# Altium project FMC_ADC.PrjPcb (part 4 of 4)

## Sheet TRIGGER.SchDoc: Trigger
size A3; Author: Wojciech Ruc³o; Organization: Warsaw Univeristy of Technology; Address1: Nowowiejska 15/19; DocumentNumber: 10; Revision: 1.0; SheetNumber: 10; SheetTotal: 12
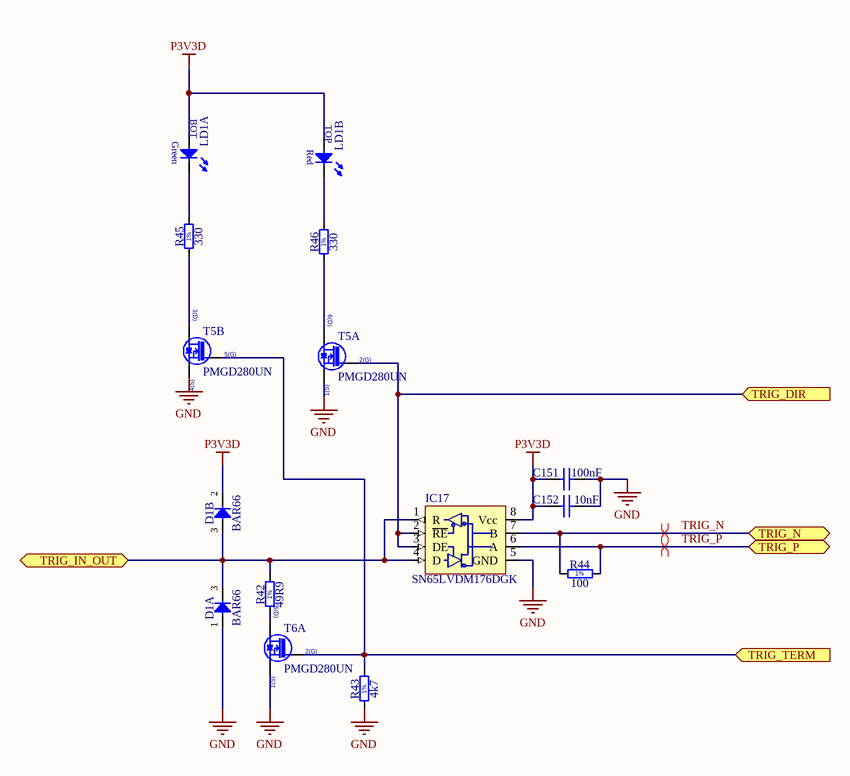
[diagram p10: TRIGGER.SchDoc]

### Parts
C151  100nF  [CAPC0603X33N]
C152  10nF  [CAPC0603X33N]
D1  BAR66  [SOT95P240X110-3N]  (parts A,B of 2)
IC17  SN65LVDM176DGK  [MSOP8 TI/AD]
LD1  (no value)  [553-xxxx-300]  (parts A,B of 2)
R42  49R9  [RESC3225X70N]
R43  4k7  [RESC1005X40N]
R44  100  [RESC1005X40N]
R45  330  [RESC1005X40N]
R46  330  [RESC1005X40N]
T5  PMGD280UN  [SOT65P210X110-6N]  (parts A,B of 2)
T6  PMGD280UN  [SOT65P210X110-6N]  (part A of 2)

### Ports
TRIG_DIR (in), TRIG_IN_OUT (bidir), TRIG_N (bidir), TRIG_P (bidir), TRIG_TERM (in)

### Nets
GND: C151.2 C152.2 D1.1(A) IC17.5(GND) R43.1 T5.1(S) T5.4(S) T6.1(S)
P3V3D: C151.1 C152.1 D1.2(C) IC17.8(Vcc) LD1.2(A) LD1.4(A)
LA22_P: IC17.2(~{RE}) IC17.3(DE) T5.2(G) ; port TRIG_DIR
LA27_N: R43.2 T5.5(G) T6.2(G) ; port TRIG_TERM
TRIG_N: IC17.7(B) R44.1 ; port TRIG_N  [project net LA11_N]
TRIG_P: IC17.6(A) R44.2 ; port TRIG_P  [project net LA11_P]
NetD1_3: D1.3(COMAC) IC17.1(R) IC17.4(D) R42.2 ; port TRIG_IN_OUT
NetLD1_1: LD1.1(C) R45.2
NetLD1_3: LD1.3(C) R46.2
NetR42_1: R42.1 T6.6(D)
NetR45_1: R45.1 T5.3(D)
NetR46_1: R46.1 T5.6(D)

### Layout directives
differential pair: LA11_N, LA11_P

### Notes on the sheet
- Title
- Size:
- Date:
- A3
- Number:
- Revision:
- Sheet
- of
- Drawn by:
- File:
- (in symbol LED x2 Red/Green 553-0711-300, part A) BOT; Green
- (in symbol LED x2 Red/Green 553-0711-300, part B) TOP; Red
- (in symbol PMGD280UN, part A) 6(D); 2(G); 1(S)
- (in symbol PMGD280UN, part B) 3(D); 5(G); 4(S)
- (in symbol R0402_4K7_1%_0.0625W_100PPM) 1%
- (in symbol R0402_100R_1%_0.0625W_100PPM) 1%
- (in symbol R0402_330R_1%_0.0625W_100PPM) 1%
- (in symbol R1210_49R9_1%_0.5W_100PPM_VISHAY_CRCW) 1%

### Library data of the parts
C151 = CC0201_100NF_6.3V_10%_X5R: Non-polarised capacitor; Part Description: SMD Multilayer Chip Ceramic Capacitor; Manufacturer: GENERIC; Manufacturer1 Part Number: 02016D104KAT2A; Voltage: 6.3V; TC: X5R; Tolerance: ±10%; Part Number: CC0201_100NF_6.3V_10%_X5R; Component Kind: Standard; Component Type: Standard; Pin Count: 2; Value: 100nF; Status: Not Recommended; Manufacturer Part Number: CC0201_100NF_6.3V_10%_X5R; Case: 0201; Mounted: Yes; Socket: No; SMD: Yes; Manufacturer1 Example: AVX; Manufacturer1 ComponentHeight: 0.33mm; HelpURL: \\cern.ch\dfs\Applications\Altium\Datasheets\CC0201_X5R_AVX.pdf; Author: CERN DEM JLC; CreateDate: 03.12.2007; LatestRevisionDate: 03.12.2007; Sense: No
C152 = CC0201_10NF_10V_10%_X5R: Non-polarised capacitor; Part Description: SMD Multilayer Chip Ceramic Capacitor; Manufacturer: GENERIC; Manufacturer1 Part Number: 0201ZD103KAT2A; Voltage: 10V; TC: X5R; Tolerance: ±10%; Part Number: CC0201_10NF_10V_10%_X5R; Component Kind: Standard; Component Type: Standard; Pin Count: 2; Value: 10nF; Status: Not Recommended; Manufacturer Part Number: CC0201_10NF_10V_10%_X5R; Case: 0201; Mounted: Yes; Socket: No; SMD: Yes; Manufacturer1 Example: AVX; Manufacturer1 ComponentHeight: 0.33mm; HelpURL: \\cern.ch\dfs\Applications\Altium\Datasheets\CC0201_X5R_AVX.pdf; Author: CERN DEM JLC; CreateDate: 03.12.2007; LatestRevisionDate: 03.12.2007; Sense: No
D1 = BAR66: Serial Diode; Part Description: Silicon PIN Diode Array (Series Connected); Manufacturer: INFINEON; Voltage: 150V; Power: 250mA; PressFit: No; Bonding: No; Part Number: BAR66; Component Kind: Standard; Component Type: Standard; Device: BAR66; PackageDescription: SOT23 3-Leads, Pitch 0.95mm - Body 1.3x2.9mm, IPC Medium Density; Manufacturer Part Number: BAR66; Pin Count: 3; Mounted: Yes; Socket: No; SMD: Yes; ComponentHeight: 1.1mm; HelpURL: \\cern.ch\dfs\Applications\Altium\Datasheets\BAR66.pdf; Author: CERN DEM JLC; CreateDate: 18.01.2010; LatestRevisionDate: 05.10.2010; Case: SOT23; Sense: No
IC17 = SN65LVDM176: High Speed Differential Transceiver LVDS/LVTTL; Manufacturer: Texas Instruments; Manufacturer Part Number: SN65LVDM176DGK
LD1 = LED x2 Red/Green 553-0711-300: Manufacturer: Dialight; Manufacturer Part Number: 553-0711-300; ComponentHeight: 9.65mm
R42 = R1210_49R9_1%_0.5W_100PPM_VISHAY_CRCW: Resistor - 1%; Part Description: Thick Film Chip Resistor; Manufacturer: VISHAY DRALORIC; Manufacturer Part Number: CRCW121049R9FKTA; Power: 0.5W; TC: ±100ppm/°C; Part Number: R1210_49R9_1%_0.5W_100PPM_VISHAY_CRCW; Component Kind: Standard; Component Type: Standard; Pin Count: 2; Value: 49R9; Status: None; Tolerance: ±1%; Case: 1210; Mounted: Yes; Sense: No; Socket: No; SMD: Yes; ComponentHeight: 0.6mm; HelpURL: \\cern.ch\dfs\Applications\Altium\Datasheets\R1210_VISHAY_CRCW1210.pdf; Author: CERN DEM JMW; CreateDate: 06.08.2014; LatestRevisionDate: 06.08.2014
R43 = R0402_4K7_1%_0.0625W_100PPM: Resistor - 1%; Part Description: General Purpose Thick Film Chip Resistor; Manufacturer: GENERIC; Manufacturer1 Part Number: 232270674702L; TC: ±100ppm/°C; Part Number: R0402_4K7_1%_0.0625W_100PPM; Component Kind: Standard; Component Type: Standard; Pin Count: 2; Value: 4k7; Status: Not recommended; Power: 0.0625W; Tolerance: ±1%; Manufacturer Part Number: R0402_4K7_1%_0.0625W_100PPM; Case: 0402; Mounted: Yes; Socket: No; SMD: Yes; Manufacturer1 Example: YAGEO PHYCOMP; Manufacturer1 ComponentHeight: 0.4mm; HelpURL: \\cern.ch\dfs\Applications\Altium\Datasheets\R0402_Phycomp_RC0402.pdf; Author: CERN DEM JLC; CreateDate: 03.12.2007; LatestRevisionDate: 17.10.2012; Sense: No
R44 = R0402_100R_1%_0.0625W_100PPM: Resistor - 1%; Part Description: General Purpose Thick Film Chip Resistor; Manufacturer: GENERIC; Manufacturer1 Part Number: 232270671001L; TC: ±100ppm/°C; Part Number: R0402_100R_1%_0.0625W_100PPM; Component Kind: Standard; Component Type: Standard; Pin Count: 2; Value: 100; Status: Not recommended; Power: 0.0625W; Tolerance: ±1%; Manufacturer Part Number: R0402_100R_1%_0.0625W_100PPM; Case: 0402; Mounted: Yes; Socket: No; SMD: Yes; Manufacturer1 Example: YAGEO PHYCOMP; Manufacturer1 ComponentHeight: 0.4mm; HelpURL: \\cern.ch\dfs\Applications\Altium\Datasheets\R0402_Phycomp_RC0402.pdf; Author: CERN DEM JLC; CreateDate: 03.12.2007; LatestRevisionDate: 17.10.2012; Sense: No
R45 R46 = R0402_330R_1%_0.0625W_100PPM: Resistor - 1%; Part Description: General Purpose Thick Film Chip Resistor; Manufacturer: GENERIC; Manufacturer1 Part Number: 232270673301L; TC: ±100ppm/°C; Part Number: R0402_330R_1%_0.0625W_100PPM; Component Kind: Standard; Component Type: Standard; Pin Count: 2; Value: 330; Status: Not recommended; Power: 0.0625W; Tolerance: ±1%; Manufacturer Part Number: R0402_330R_1%_0.0625W_100PPM; Case: 0402; Mounted: Yes; Sense: No; Socket: No; SMD: Yes; Manufacturer1 Example: YAGEO PHYCOMP; Manufacturer1 ComponentHeight: 0.4mm; HelpURL: \\cern.ch\dfs\Applications\Altium\Datasheets\R0402_Phycomp_RC0402.pdf; Author: CERN DEM JLC; CreateDate: 03.12.2007; LatestRevisionDate: 17.10.2012
T5 T6 = PMGD280UN: as T1-T3 on sheet ANALOG_INPUT; Part Number: PMGD280UN; Component Kind: Standard; Component Type: Standard; Device: PMGD280UN; PackageDescription: SOT363, SC70-6, SOT, 0.65mm Pitch, 6 pin, 1.25mm W X 2.00mm L X 1.10mm H, IPC Medium Density; Manufacturer Part Number: PMGD280UN; Pin Count: 6; Case: SOT363; Mounted: Yes; Socket: No; SMD: Yes; Sense: No; ComponentHeight: 1.1mm; HelpURL: \\cern.ch\dfs\Applications\Altium\Datasheets\PMGD280UN.pdf; Author: CERN DEM JLC; CreateDate: 19.11.2014; LatestRevisionDate: 19.11.2014

## Sheet ANALOG_INPUT_CTRL.SchDoc: Analog Input Control
size A3; Author: Wojciech Ruc³o; Organization: Warsaw Univeristy of Technology; Address1: Nowowiejska 15/19; DocumentNumber: 4; Revision: 1.0; SheetNumber: 4; SheetTotal: 12
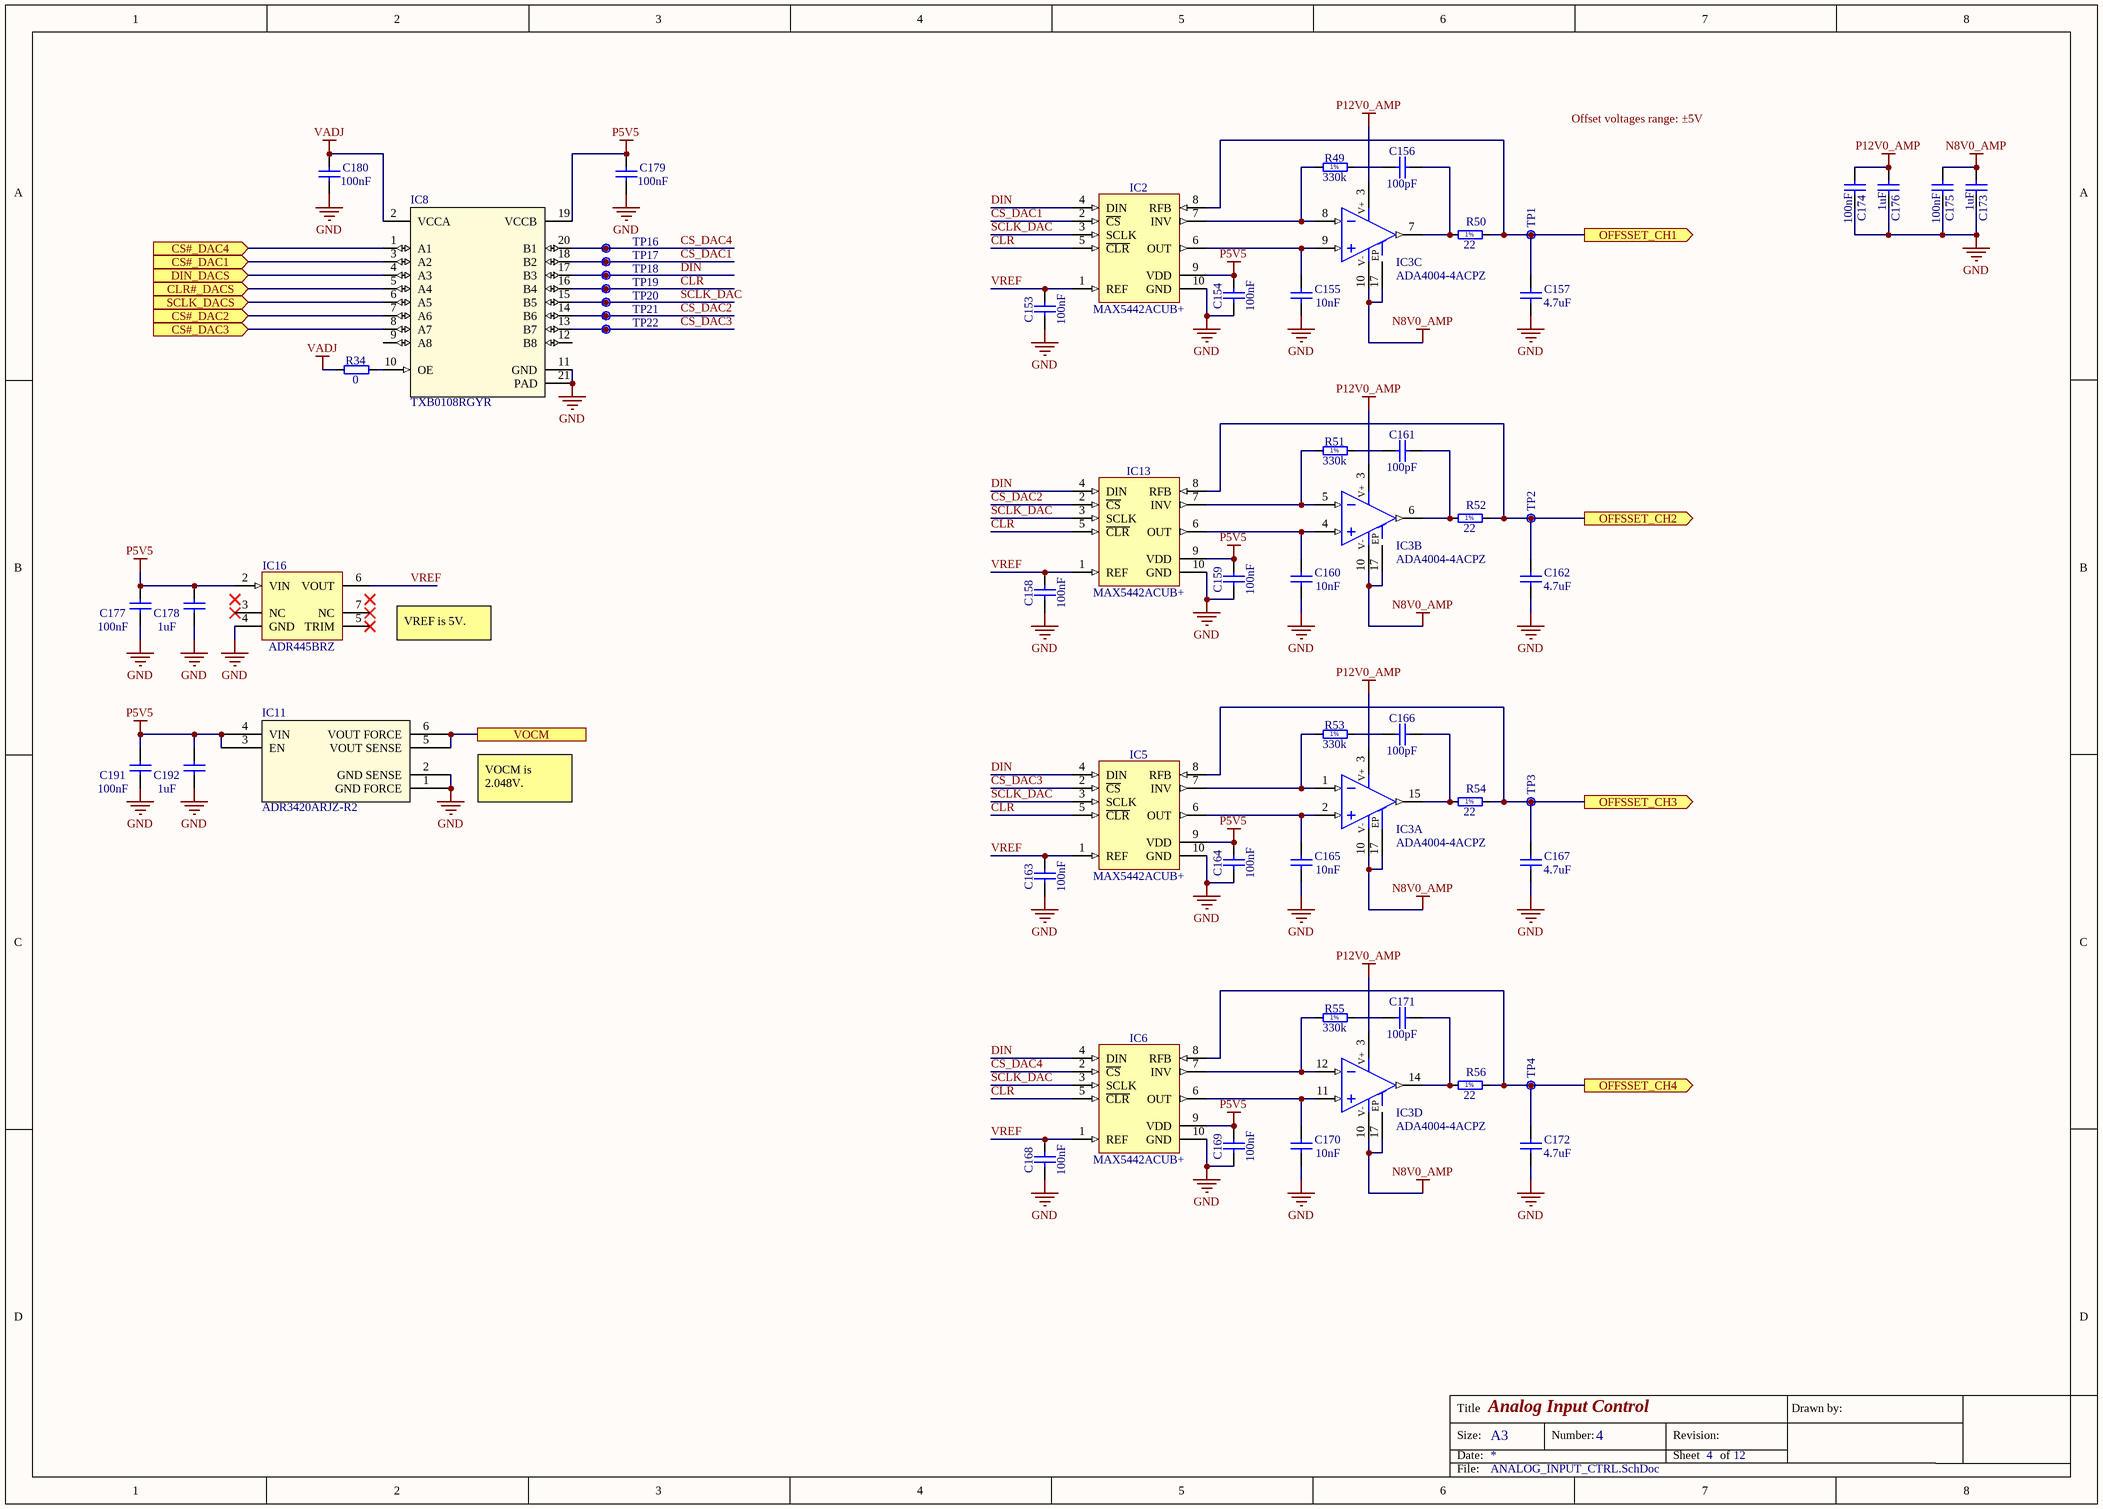
[diagram p11: ANALOG_INPUT_CTRL.SchDoc]

### Parts
C153  100nF  [CAPC1005X55N]
C154  100nF  [CAPC1005X55N]
C155  10nF  [CAPC1608X87N]
C156  100pF  [CAPC1608X87N]
C157  4.7uF  [CAPC2012X135N]
C158  100nF  [CAPC1005X55N]
C159  100nF  [CAPC1005X55N]
C160  10nF  [CAPC1608X87N]
C161  100pF  [CAPC1608X87N]
C162  4.7uF  [CAPC2012X135N]
C163  100nF  [CAPC1005X55N]
C164  100nF  [CAPC1005X55N]
C165  10nF  [CAPC1608X87N]
C166  100pF  [CAPC1608X87N]
C167  4.7uF  [CAPC2012X135N]
C168  100nF  [CAPC1005X55N]
C169  100nF  [CAPC1005X55N]
C170  10nF  [CAPC1608X87N]
C171  100pF  [CAPC1608X87N]
C172  4.7uF  [CAPC2012X135N]
C173  1uF  [CAPC1608X87N]
C174  100nF  [CAPC1608X87N]
C175  100nF  [CAPC1608X87N]
C176  1uF  [CAPC1608X87N]
C177  100nF  [CAPC1005X55N]
C178  1uF  [CAPC1608X87N]
C179  100nF  [CAPC0603X33N]
C180  100nF  [CAPC0603X33N]
C191  100nF  [CAPC1005X55N]
C192  1uF  [CAPC1608X87N]
IC2  MAX5442ACUB+  [SOP50P490X110-10N]
IC3  ADA4004-4ACPZ  [QFN65P400X400X100-17N-S225]  (parts A,B,C,D of 4)
IC5  MAX5442ACUB+  [SOP50P490X110-10N]
IC6  MAX5442ACUB+  [SOP50P490X110-10N]
IC8  TXB0108RGYR  [RGY20_3P05x2P05]
IC11  ADR3420ARJZ-R2  [RJ_6]
IC13  MAX5442ACUB+  [SOP50P490X110-10N]
IC16  ADR445BRZ  [SOIC127P600X175-8N]
R34  0  [RESC1005X40N]
R49  330k  [RESC1608X55N]
R50  22  [RESC1608X55N]
R51  330k  [RESC1608X55N]
R52  22  [RESC1608X55N]
R53  330k  [RESC1608X55N]
R54  22  [RESC1608X55N]
R55  330k  [RESC1608X55N]
R56  22  [RESC1608X55N]
TP1  (no value)  [TPS127]
TP2  (no value)  [TPS127]
TP3  (no value)  [TPS127]
TP4  (no value)  [TPS127]
TP16  Test Point  [TPS62]  (value not drawn)
TP17  Test Point  [TPS62]  (value not drawn)
TP18  Test Point  [TPS62]  (value not drawn)
TP19  Test Point  [TPS62]  (value not drawn)
TP20  Test Point  [TPS62]  (value not drawn)
TP21  Test Point  [TPS62]  (value not drawn)
TP22  Test Point  [TPS62]  (value not drawn)

### Ports
CLR#_DACS (in), CS#_DAC1 (in), CS#_DAC2 (in), CS#_DAC3 (in), CS#_DAC4 (in), DIN_DACS (in), OFFSSET_CH1 (out), OFFSSET_CH2 (out), OFFSSET_CH3 (out), OFFSSET_CH4 (out), SCLK_DACS (in), VOCM

### Nets
GND: C153.1 C154.1 C155.1 C157.2 C158.1 C159.1 C160.1 C162.2 C163.1 C164.1 C165.1 C167.2 C168.1 C169.1 C170.1 C172.2 C173.2 C174.2 C175.2 C176.2 C177.1 C178.1 C179.1 C180.1 C191.1 C192.1 IC2.10(GND) IC5.10(GND) IC6.10(GND) IC8.11(GND) IC8.21(PAD) IC11.1(GND_FORCE) IC11.2(GND_SENSE) IC13.10(GND) IC16.4(GND)
N8V0_AMP: C173.1 C175.1 IC3.10(V-) IC3.17(EP)
P5V5: C154.2 C159.2 C164.2 C169.2 C177.2 C178.2 C179.2 C191.2 C192.2 IC2.9(VDD) IC5.9(VDD) IC6.9(VDD) IC8.19(VCCB) IC11.3(EN) IC11.4(VIN) IC13.9(VDD) IC16.2(VIN)
P12V0_AMP: C174.1 C176.1 IC3.3(V+)
VADJ: C180.2 IC8.2(VCCA) R34.1
CLR: IC2.5(~{CLR}) IC5.5(~{CLR}) IC6.5(~{CLR}) IC8.16(B4) IC13.5(~{CLR}) TP19.1
CLR#_DACS: IC8.5(A4) ; port CLR#_DACS
CS#_DAC1: IC8.3(A2) ; port CS#_DAC1
CS#_DAC2: IC8.7(A6) ; port CS#_DAC2
CS#_DAC3: IC8.8(A7) ; port CS#_DAC3
CS#_DAC4: IC8.1(A1) ; port CS#_DAC4
CS_DAC1: IC2.2(~{CS}) IC8.18(B2) TP17.1
CS_DAC2: IC8.14(B6) IC13.2(~{CS}) TP21.1
CS_DAC3: IC5.2(~{CS}) IC8.13(B7) TP22.1
CS_DAC4: IC6.2(~{CS}) IC8.20(B1) TP16.1
DIN: IC2.4(DIN) IC5.4(DIN) IC6.4(DIN) IC8.17(B3) IC13.4(DIN) TP18.1
DIN_DACS: IC8.4(A3) ; port DIN_DACS
LA02_P: IC8.6(A5) ; port SCLK_DACS
OFFSET_CH1: C157.1 IC2.8(RFB) R50.2 TP1.1 ; port OFFSSET_CH1
OFFSET_CH2: C162.1 IC13.8(RFB) R52.2 TP2.1 ; port OFFSSET_CH2
OFFSET_CH3: C167.1 IC5.8(RFB) R54.2 TP3.1 ; port OFFSSET_CH3
OFFSET_CH4: C172.1 IC6.8(RFB) R56.2 TP4.1 ; port OFFSSET_CH4
SCLK_DAC: IC2.3(SCLK) IC5.3(SCLK) IC6.3(SCLK) IC8.15(B5) IC13.3(SCLK) TP20.1
VOCM: IC11.5(VOUT_SENSE) IC11.6(VOUT_FORCE) ; port VOCM
VREF: C153.2 C158.2 C163.2 C168.2 IC2.1(REF) IC5.1(REF) IC6.1(REF) IC13.1(REF) IC16.6(VOUT)
NetC155_2: C155.2 IC2.6(OUT) IC3.9(IN+)
NetC156_1: C156.1 R49.2
NetC156_2: C156.2 IC3.7(OUT) R50.1
NetC160_2: C160.2 IC3.4(IN+) IC13.6(OUT)
NetC161_1: C161.1 R51.2
NetC161_2: C161.2 IC3.6(OUT) R52.1
NetC165_2: C165.2 IC3.2(IN+) IC5.6(OUT)
NetC166_1: C166.1 R53.2
NetC166_2: C166.2 IC3.15(OUT) R54.1
NetC170_2: C170.2 IC3.11(IN+) IC6.6(OUT)
NetC171_1: C171.1 R55.2
NetC171_2: C171.2 IC3.14(OUT) R56.1
NetIC2_7: IC2.7(INV) IC3.8(IN-) R49.1
NetIC3_1: IC3.1(IN-) IC5.7(INV) R53.1
NetIC3_5: IC3.5(IN-) IC13.7(INV) R51.1
NetIC3_12: IC3.12(IN-) IC6.7(INV) R55.1
NetIC8_10: IC8.10(OE) R34.2

Not connected (* = marked no-connect by the designer): IC8 9(A8) 12(B8); IC16 3(NC)* 5(TRIM)* 7(NC)*

### Notes on the sheet
- Offset voltages range: ±5V
- VREF is 5V.
- VOCM is 2.048V.
- Title
- Size:
- Date:
- A3
- Number:
- Revision:
- Sheet
- of
- Drawn by:
- File:
- (in symbol R0603_22R_1%_0.1W_100PPM) 1%
- (in symbol R0603_330K_1%_0.1W_100PPM) 1%

### Library data of the parts
C153 C154 C158 C159 C163 C164 C168 C169 C177 C191 = CC0402_100NF_16V_10%_X7R: Non-polarised capacitor; Part Description: SMD Multilayer Chip Ceramic Capacitor; Manufacturer: GENERIC; Manufacturer1 Part Number: GRM155R71C104KA88D; Voltage: 16V; TC: X7R; Tolerance: ±10%; Part Number: CC0402_100NF_16V_10%_X7R; Component Kind: Standard; Component Type: Standard; Pin Count: 2; Value: 100nF; Status: Not Recommended; Manufacturer Part Number: CC0402_100NF_16V_10%_X7R; Case: 0402; Mounted: Yes; Socket: No; SMD: Yes; Sense: No; Manufacturer1 Example: MURATA; Manufacturer1 ComponentHeight: 0.55mm; HelpURL: \\cern.ch\dfs\Applications\Altium\Datasheets\CC0402_X7R_MURATA_GRM.pdf; Author: CERN DEM JLC; CreateDate: 05.12.2013; LatestRevisionDate: 03.12.2007
C155 C160 C165 C170 = CC0603_10NF_50V_10%_X7R: Non-polarised capacitor; Manufacturer1 Part Number: 223858615636; Manufacturer: GENERIC; Part Description: SMD Multilayer Chip Ceramic Capacitor; TC: X7R; Tolerance: ±10%; Voltage: 50V; Author: CERN DEM JLC; Case: 0603; Component Type: Standard; CreateDate: 03.12.2007; HelpURL: \\cern.ch\dfs\Applications\Altium\Datasheets\CC0603_X7R_PHYCOMP.pdf; LatestRevisionDate: 03.12.2007; Manufacturer1 ComponentHeight: 0.87mm; Manufacturer1 Example: PHYCOMP; Manufacturer Part Number: CC0603_10NF_50V_10%_X7R; Mounted: Yes; Pin Count: 2; SMD: Yes; Socket: No; Status: Preferred; Value: 10nF; Part Number: CC0603_10NF_50V_10%_X7R; Component Kind: Standard; Sense: No
C156 C161 C166 C171 = CC0603_100PF_50V_5%_NP0: Non-polarised capacitor; Part Description: SMD Multilayer Chip Ceramic Capacitor; Manufacturer: GENERIC; Manufacturer1 Part Number: 223886715101; Voltage: 50V; TC: C0G/NP0; Tolerance: ±5%; Part Number: CC0603_100PF_50V_5%_NP0; Component Kind: Standard; Component Type: Standard; Pin Count: 2; Value: 100pF; Status: Preferred; Manufacturer Part Number: CC0603_100PF_50V_5%_NP0; Case: 0603; Mounted: Yes; Socket: No; SMD: Yes; Manufacturer1 Example: PHYCOMP; Manufacturer1 ComponentHeight: 0.87mm; HelpURL: \\cern.ch\dfs\Applications\Altium\Datasheets\CC0603_NP0_PHYCOMP.pdf; Author: CERN DEM JLC; CreateDate: 03.12.2007; LatestRevisionDate: 03.12.2007; Sense: No
C157 C162 C167 C172 = CC0805_4.7UF_16V_10%_X7R: Non-polarised capacitor; Part Description: SMD Multilayer Chip Ceramic Capacitor; Manufacturer: GENERIC; Manufacturer1 Part Number: EMK212B7475KG-T; Voltage: 16V; TC: X7R; Tolerance: ±10%; Part Number: CC0805_4.7UF_16V_10%_X7R; Component Kind: Standard; Component Type: Standard; Pin Count: 2; Value: 4.7uF; Status: Preferred; Manufacturer Part Number: CC0805_4.7UF_16V_10%_X7R; Case: 0805; Mounted: Yes; Socket: No; SMD: Yes; Sense: No; Manufacturer1 Example: TAIYO YUDEN; Manufacturer1 ComponentHeight: 1.35mm; HelpURL: \\cern.ch\dfs\Applications\Altium\Datasheets\CC0805_X7R_TAIYO-YUDEN_HIGH-VALUE.pdf; Author: CERN DEM JLC; CreateDate: 16.09.2014; LatestRevisionDate: 16.09.2014
C173 C176 = CC0603_1UF_16V_10%_X7R: Non-polarised capacitor; Part Description: SMD Multilayer Chip Ceramic Capacitor; Manufacturer: GENERIC; Manufacturer1 Part Number: 223878615663; Voltage: 16V; TC: X7R; Tolerance: ±10%; Part Number: CC0603_1UF_16V_10%_X7R; Value: 1uF; Component Kind: Standard; Component Type: Standard; Pin Count: 2; Status: None; Manufacturer Part Number: CC0603_1uF_16V_10%_X7R; Case: 0603; Mounted: Yes; Socket: No; SMD: Yes; Sense: No; Manufacturer1 Example: YAGEO PHYCOMP; Manufacturer1 ComponentHeight: 0.9mm; HelpURL: \\cern.ch\dfs\Applications\Altium\Datasheets\CC0603_X7R_PHYCOMP.pdf; Author: CERN DEM JLC; CreateDate: 03.12.2007; LatestRevisionDate: 17.04.2015
C174 C175 = CC0603_100NF_50V_10%_X7R: Non-polarised capacitor; Part Description: SMD Multilayer Chip Ceramic Capacitor; Manufacturer: GENERIC; Manufacturer1 Part Number: 223858615649; Voltage: 50V; TC: X7R; Tolerance: ±10%; Part Number: CC0603_100NF_50V_10%_X7R; Value: 100nF; Component Kind: Standard; Component Type: Standard; Pin Count: 2; Status: Preferred; Manufacturer Part Number: CC0603_100NF_50V_10%_X7R; Case: 0603; Mounted: Yes; Socket: No; SMD: Yes; Sense: No; Manufacturer1 Example: PHYCOMP; Manufacturer1 ComponentHeight: 0.87mm; HelpURL: \\cern.ch\dfs\Applications\Altium\Datasheets\CC0603_X7R_PHYCOMP.pdf; Author: CERN DEM JLC; CreateDate: 03.12.2007; LatestRevisionDate: 03.12.2007
C178 C192 = CC0603_1UF_16V_10%_X7R: Non-polarised capacitor; Manufacturer1 Part Number: 223878615663; Manufacturer: GENERIC; Part Description: SMD Multilayer Chip Ceramic Capacitor; TC: X7R; Tolerance: ±10%; Voltage: 16V; Author: CERN DEM JLC; Case: 0603; Component Type: Standard; CreateDate: 03.12.2007; HelpURL: \\cern.ch\dfs\Applications\Altium\Datasheets\CC0603_X7R_PHYCOMP.pdf; LatestRevisionDate: 17.04.2015; Manufacturer1 ComponentHeight: 0.9mm; Manufacturer1 Example: YAGEO PHYCOMP; Manufacturer Part Number: CC0603_1uF_16V_10%_X7R; Mounted: Yes; Pin Count: 2; SMD: Yes; Socket: No; Status: None; Value: 1uF; Part Number: CC0603_1UF_16V_10%_X7R; Component Kind: Standard; Sense: No
C179 C180 = CC0201_100NF_6.3V_10%_X5R: Non-polarised capacitor; Part Description: SMD Multilayer Chip Ceramic Capacitor; Manufacturer: GENERIC; Manufacturer1 Part Number: 02016D104KAT2A; Tolerance: ±10%; Voltage: 6.3V; TC: X5R; Value: 100nF; Part Number: CC0201_100NF_6.3V_10%_X5R; Component Kind: Standard; Component Type: Standard; Pin Count: 2; Status: Not Recommended; Manufacturer Part Number: CC0201_100NF_6.3V_10%_X5R; Case: 0201; Mounted: Yes; Socket: No; SMD: Yes; Sense: No; Manufacturer1 Example: AVX; Manufacturer1 ComponentHeight: 0.33mm; HelpURL: \\cern.ch\dfs\Applications\Altium\Datasheets\CC0201_X5R_AVX.pdf; Author: CERN DEM JLC; CreateDate: 03.12.2007; LatestRevisionDate: 03.12.2007
IC2 IC5 IC6 IC13 = MAX5442ACUB+: +5V, Serial-Input, Voltage-Output, 16-Bit ±2LSB DAC; Manufacturer: MAXIM; PressFit: No; Bonding: No; Part Number: MAX5442ACUB+; Component Kind: Standard; Component Type: Standard; Device: MAX5442ACUB+; PackageDescription: TSSOP, 10-Leads, Body 3.2x3.2mm (max), Pitch 0.50mm, IPC Medium Density; Part Description: +5V, Serial-Input, Voltage-Output, 16-Bit ±2LSB DAC; Manufacturer Part Number: MAX5442ACUB+; Pin Count: 10; Case: MSOP10; Mounted: Yes; Socket: No; SMD: Yes; ComponentHeight: 1.1mm; Author: CERN DEM JLC; HelpURL: \\cern.ch\dfs\Applications\Altium\Datasheets\MAX5442ACUB+.pdf; CreateDate: 12.01.2010; LatestRevisionDate: 12.01.2010; Sense: No
IC3 = ADA4004-4ACPZ: Quad Operational Amplifier; Part Description: 1.8nV/sqrt Hz, 36V Precision Amplifiers; Manufacturer: ANALOG DEVICES; PressFit: No; Bonding: No; Part Number: ADA4004-4ACPZ; Component Kind: Standard; Component Type: Standard; Device: ADA4004-4ACPZ; PackageDescription: QFN, 0.65mm pitch,square; 4 pin X 4 pin, 4mm X 4mm X 1mm H body (w/thermal tab 2.25 X 2.25mm),  IPC Medium Density; Manufacturer Part Number: ADA4004-4ACPZ; Pin Count: 14; Case: QFN16; Mounted: Yes; Socket: No; SMD: Yes; Sense: No; ComponentHeight: 1.75mm; Author: CERN DEM JLC; HelpURL: \\cern.ch\dfs\Applications\Altium\Datasheets\ADA4004-4ACPZ.pdf; CreateDate: 13.01.2010; LatestRevisionDate: 09.02.2010
IC8 = TXB0108RGYR: 8-Bit Bidirectional Voltage-Level Translator with Auto-Direction Sensing; Manufacturer: Texas Instruments; Application_BuildNumber: *; PackageReference: RGY0020A; RoHS: Y; Manufacturer Part Number: TXB0108RGYR
IC11 = ADR3420ARJZ-R2: Micropower, High Accuracy Voltage References - 2.048V; Manufacturer: Analog Devices; Manufacturer Part Number: ADR3420ARJZ-R2
IC16 = ADR445BRZ: 5V Ultralow Noise, LDO XFET Voltage References with Current Sink and Source; Part Description: 5V Output, ±2mV ±0.04% Accuracy, 3ppm/°C Ultralow Noise, LDO XFET Voltage References with Current Sink and Source; Manufacturer: ANALOG DEVICES; PressFit: No; Bonding: No; Part Number: ADR445BRZ; Component Kind: Standard; Component Type: Standard; Device: ADR445BRZ; PackageDescription: SOIC 8, Pitch 1.27mm, Body 4x5mm, IPC Medium Density; Manufacturer Part Number: ADR445BRZ; Pin Count: 5; Case: SOIC8; Mounted: Yes; Socket: No; SMD: Yes; ComponentHeight: 1.75mm; HelpURL: \\cern.ch\dfs\Applications\Altium\Datasheets\ADR445BRZ.pdf; Author: CERN DEM JLC; CreateDate: 08.03.2010; LatestRevisionDate: 08.03.2010; Sense: No
R34 = R0402_0R_JUMPER: Resistor; Part Description: 1A (0.05R Max DC Resistance) Zero Ohm Jumper; Manufacturer: GENERIC; Manufacturer1 Part Number: 232270591001L; Part Number: R0402_0R_JUMPER; Component Kind: Standard; Component Type: Standard; Pin Count: 2; Value: 0; Status: Not recommended; Manufacturer Part Number: R0402_0R_JUMPER; Case: 0402; Mounted: Yes; Sense: No; Socket: No; SMD: Yes; Manufacturer1 Example: YAGEO PHYCOMP; Manufacturer1 ComponentHeight: 0.4mm; HelpURL: \\cern.ch\dfs\Applications\Altium\Datasheets\R0402_Phycomp_RC0402.pdf; Author: CERN DEM JLC; CreateDate: 03.12.2007; LatestRevisionDate: 17.10.2012
R49 R51 R53 R55 = R0603_330K_1%_0.1W_100PPM: Resistor - 1%; Part Description: General Purpose Thick Film Chip Resistor; Manufacturer: GENERIC; Manufacturer1 Part Number: NRC06F3303TRF; Power: 0.1W; TC: ±100ppm/°C; Part Number: R0603_330K_1%_0.1W_100PPM; Component Kind: Standard; Component Type: Standard; Pin Count: 2; Value: 330k; Status: Preferred; Tolerance: ±1%; Manufacturer Part Number: R0603_330K_1%_0.1W_100PPM; Case: 0603; Mounted: Yes; Socket: No; SMD: Yes; Manufacturer1 Example: NIC COMPONENT; Manufacturer1 ComponentHeight: 0.55mm; HelpURL: \\cern.ch\dfs\Applications\Altium\Datasheets\R0603_NIC_NRC.pdf; Author: CERN DEM JLC; CreateDate: 03.12.2007; LatestRevisionDate: 13.03.2008; Sense: No
R50 R52 R54 R56 = R0603_22R_1%_0.1W_100PPM: Resistor - 1%; Manufacturer1 Part Number: NRC06F22R0TRF; Manufacturer: GENERIC; Part Description: General Purpose Thick Film Chip Resistor; Power: 0.1W; TC: ±100ppm/°C; Author: CERN DEM JLC; Case: 0603; Component Type: Standard; CreateDate: 03.12.2007; HelpURL: \\cern.ch\dfs\Applications\Altium\Datasheets\R0603_NIC_NRC.pdf; LatestRevisionDate: 13.03.2008; Manufacturer1 ComponentHeight: 0.55mm; Manufacturer1 Example: NIC COMPONENT; Manufacturer Part Number: R0603_22R_1%_0.1W_100PPM; Mounted: Yes; Pin Count: 2; SMD: Yes; Socket: No; Status: Preferred; Tolerance: ±1%; Value: 22; Part Number: R0603_22R_1%_0.1W_100PPM; Component Kind: Standard; Sense: No
TP1-TP4 = SMD_PAD_1.27X1.27MM: Test Point; Part Description: 1.27mm x 1.27mm PCB Copper Area (SMD Test Point); Mounted: No; Part Number: SMD_PAD_1.27X1.27MM; Component Kind: Standard (No BOM); Component Type: Standard (No BOM); Pin Count: 1; Family: Test Point; Socket: No; SMD: Yes; Sense: No; Status: None; ComponentHeight: 0mm; HelpURL: Undefined; Author: CERN DEM JLC; CreateDate: 12.01.2008; LatestRevisionDate: 12.01.2008; PackageDescription: 1.27mm x 1.27mm PCB Copper Area (SMD Test Point)
TP16-TP22 = SMD_PAD_0.62X0.62MM: Part Description: 0.62mm x 0.62mm PCB Copper Area (SMD Test Point); Mounted: No; Part Number: SMD_PAD_0.62X0.62MM; Component Kind: Standard (No BOM); Component Type: Standard (No BOM); Pin Count: 1; Family: Test Point; Socket: No; SMD: Yes; Sense: No; Status: None; ComponentHeight: 0mm; HelpURL: Undefined; Author: CERN DEM JLC; CreateDate: 12.01.2008; LatestRevisionDate: 12.01.2008; PackageDescription: 0.62mm x 0.62mm PCB Copper Area (SMD Test Point)

## Nets that join several sheets
3P3V: FMC_CONNECTOR (R98.2), CON_FMC_400PIN (J6.c39 J6.d36 J6.d38 J6.d40), POWER_SUPPLY_2 (13 pins)
3P3VAUX: FMC_CONNECTOR (C78.2 IC12.8), CON_FMC_400PIN (J6.d32), VOLTAGE_MONITOR (6 pins)
12P0V: CON_FMC_400PIN (J6.c35 J6.c37), POWER_SUPPLY_1 (16 pins)
GND: FMC_ADC_top (6 pins), FMC_CONNECTOR (10 pins), CON_FMC_400PIN (160 pins), U_ADC2 (45 pins), CLOCK (30 pins), POWER_SUPPLY_1 (50 pins), U_ANALOG_INPUT_D (24 pins), U_ADC1 (45 pins), U_ANALOG_INPUT_C (24 pins), U_ANALOG_INPUT_B (24 pins), U_ANALOG_INPUT_A (24 pins), LEVEL_TRANSLATORS (8 pins), POWER_SUPPLY_2 (30 pins), VOLTAGE_MONITOR (14 pins), TRIGGER (8 pins), ANALOG_INPUT_CTRL (35 pins)
N5V0: POWER_SUPPLY_1 (L22.2), U_ANALOG_INPUT_D (10 pins), U_ANALOG_INPUT_C (10 pins), U_ANALOG_INPUT_B (10 pins), U_ANALOG_INPUT_A (10 pins)
N8V0_AMP: POWER_SUPPLY_1 (C240.2 L23.2), ANALOG_INPUT_CTRL (C173.1 C175.1 IC3.10 IC3.17)
P1V25_AVDD1: U_ADC2 (20 pins), U_ADC1 (20 pins), POWER_SUPPLY_2 (C227.2 L12.2 L13.2), VOLTAGE_MONITOR (IC7.1)
P1V25_DRVDD: U_ADC2 (6 pins), U_ADC1 (6 pins), POWER_SUPPLY_2 (C223.2 L11.2)
P1V25_DVDD: U_ADC2 (6 pins), U_ADC1 (6 pins), POWER_SUPPLY_2 (C222.2 L10.2), VOLTAGE_MONITOR (IC7.20)
P2V5_AVDD2: U_ADC2 (26 pins), U_ADC1 (26 pins), POWER_SUPPLY_2 (C228.2 L15.2), VOLTAGE_MONITOR (R32.2)
P3V3_AVDD3: U_ADC2 (8 pins), POWER_SUPPLY_1 (L4.2), U_ADC1 (8 pins), VOLTAGE_MONITOR (R26.2)
P3V3_CLKVDD: CLOCK (39 pins), POWER_SUPPLY_1 (C215.2 L24.2), LEVEL_TRANSLATORS (C204.2 IC19.19), VOLTAGE_MONITOR (R28.2)
P3V3_SPIVDD: U_ADC2 (C14A.2 C15A.2 IC1A.13 IC1A.38), U_ADC1 (C14B.2 C15B.2 IC1B.13 IC1B.38), LEVEL_TRANSLATORS (C202.2 IC18.19), POWER_SUPPLY_2 (L17.2)
P3V3D: FMC_CONNECTOR (LD2.2 LD2.4 LD4.2 LD4.4), U_ANALOG_INPUT_D (5 pins), U_ANALOG_INPUT_C (5 pins), U_ANALOG_INPUT_B (5 pins), U_ANALOG_INPUT_A (5 pins), POWER_SUPPLY_2 (C229.2 L16.2), TRIGGER (6 pins)
P5V0: POWER_SUPPLY_1 (L1.2), U_ANALOG_INPUT_D (12 pins), U_ANALOG_INPUT_C (12 pins), U_ANALOG_INPUT_B (12 pins), U_ANALOG_INPUT_A (12 pins), VOLTAGE_MONITOR (R30.2)
P5V5: POWER_SUPPLY_1 (L2.2), ANALOG_INPUT_CTRL (17 pins)
P12V0_AMP: POWER_SUPPLY_1 (C232.2 L18.2), ANALOG_INPUT_CTRL (C174.1 C176.1 IC3.3)
VADJ: FMC_CONNECTOR (R99.2), CON_FMC_400PIN (J6.e39 J6.f40 J6.g39 J6.h40), LEVEL_TRANSLATORS (7 pins), ANALOG_INPUT_CTRL (C180.2 IC8.2 R34.1)
ATT_A_CH1: CON_FMC_400PIN (J6.g31), U_ANALOG_INPUT_A (T2D.2)
ATT_A_CH2: CON_FMC_400PIN (J6.h28), U_ANALOG_INPUT_B (T2C.2)
ATT_A_CH3: CON_FMC_400PIN (J6.d17), U_ANALOG_INPUT_C (T2B.2)
ATT_A_CH4: CON_FMC_400PIN (J6.c15), U_ANALOG_INPUT_D (T2A.2)
ATT_B_CH1: CON_FMC_400PIN (J6.g25), U_ANALOG_INPUT_A (T2D.5)
ATT_B_CH2: CON_FMC_400PIN (J6.h29), U_ANALOG_INPUT_B (T2C.5)
ATT_B_CH3: CON_FMC_400PIN (J6.d15), U_ANALOG_INPUT_C (T2B.5)
ATT_B_CH4: CON_FMC_400PIN (J6.d11), U_ANALOG_INPUT_D (T2A.5)
CLK_ADC1_N: CLOCK (IC4.26), U_ADC1 (C39B.1 R1B.1)
CLK_ADC1_P: CLOCK (IC4.25), U_ADC1 (C38B.1 R1B.2)
CLK_ADC2_N: U_ADC2 (C39A.1 R1A.1), CLOCK (IC4.68)
CLK_ADC2_P: U_ADC2 (C38A.1 R1A.2), CLOCK (IC4.67)
CLK_FPGA_N: CON_FMC_400PIN (J6.d21), CLOCK (IC4.29)
CLK_FPGA_P: CON_FMC_400PIN (J6.d20), CLOCK (IC4.28)
CLK_MGT_N: CON_FMC_400PIN (J6.d5), CLOCK (IC4.53)
CLK_MGT_P: CON_FMC_400PIN (J6.d4), CLOCK (IC4.52)
CLR#_DACS: CON_FMC_400PIN (J6.h10), ANALOG_INPUT_CTRL (IC8.5)
CS#_DAC1: CON_FMC_400PIN (J6.h11), ANALOG_INPUT_CTRL (IC8.3)
CS#_DAC2: CON_FMC_400PIN (J6.g13), ANALOG_INPUT_CTRL (IC8.7)
CS#_DAC3: CON_FMC_400PIN (J6.g12), ANALOG_INPUT_CTRL (IC8.8)
CS#_DAC4: CON_FMC_400PIN (J6.h13), ANALOG_INPUT_CTRL (IC8.1)
CS_ADC1: U_ADC1 (IC1B.37), LEVEL_TRANSLATORS (IC18.18 TP8.1)
CS_ADC1_FMC: CON_FMC_400PIN (J6.h38), LEVEL_TRANSLATORS (IC18.3)
CS_ADC2: U_ADC2 (IC1A.37), LEVEL_TRANSLATORS (IC18.13 TP11.1)
CS_ADC2_FMC: CON_FMC_400PIN (J6.g33), LEVEL_TRANSLATORS (IC18.8)
CS_CLK: CLOCK (IC4.21), LEVEL_TRANSLATORS (IC19.16 TP15.1)
CS_CLK_FMC: CON_FMC_400PIN (J6.g19), LEVEL_TRANSLATORS (IC19.5)
DIN_DACS: CON_FMC_400PIN (J6.h8), ANALOG_INPUT_CTRL (IC8.4)
DP0_M2C_N: CON_FMC_400PIN (J6.c7), U_ADC2 (C42A.2)
DP0_M2C_P: CON_FMC_400PIN (J6.c6), U_ADC2 (C43A.2)
DP1_M2C_N: CON_FMC_400PIN (J6.a3), U_ADC2 (C66A.2)
DP1_M2C_P: CON_FMC_400PIN (J6.a2), U_ADC2 (C67A.2)
DP2_M2C_N: CON_FMC_400PIN (J6.a7), U_ADC2 (C64A.2)
DP2_M2C_P: CON_FMC_400PIN (J6.a6), U_ADC2 (C65A.2)
DP3_M2C_N: CON_FMC_400PIN (J6.a11), U_ADC2 (C40A.2)
DP3_M2C_P: CON_FMC_400PIN (J6.a10), U_ADC2 (C41A.2)
DP4_M2C_N: CON_FMC_400PIN (J6.a15), U_ADC1 (C64B.2)
DP4_M2C_P: CON_FMC_400PIN (J6.a14), U_ADC1 (C65B.2)
DP5_M2C_N: CON_FMC_400PIN (J6.a19), U_ADC1 (C40B.2)
DP5_M2C_P: CON_FMC_400PIN (J6.a18), U_ADC1 (C41B.2)
DP6_M2C_N: CON_FMC_400PIN (J6.b17), U_ADC1 (C42B.2)
DP6_M2C_P: CON_FMC_400PIN (J6.b16), U_ADC1 (C43B.2)
DP7_M2C_N: CON_FMC_400PIN (J6.b13), U_ADC1 (C66B.2)
DP7_M2C_P: CON_FMC_400PIN (J6.b12), U_ADC1 (C67B.2)
FD_A: U_ADC1 (IC1B.17), LEVEL_TRANSLATORS (IC18.20), VOLTAGE_MONITOR (R104.2)
FD_A_FMC: CON_FMC_400PIN (J6.h31), LEVEL_TRANSLATORS (IC18.1)
FD_B: U_ADC1 (IC1B.32), LEVEL_TRANSLATORS (IC18.15)
FD_B_FMC: CON_FMC_400PIN (J6.g36), LEVEL_TRANSLATORS (IC18.6)
FD_C: U_ADC2 (IC1A.17), LEVEL_TRANSLATORS (IC18.14), VOLTAGE_MONITOR (R102.2)
FD_C_FMC: CON_FMC_400PIN (J6.g34), LEVEL_TRANSLATORS (IC18.7)
FD_D: U_ADC2 (IC1A.32), LEVEL_TRANSLATORS (IC18.12)
FD_D_FMC: CON_FMC_400PIN (J6.h32), LEVEL_TRANSLATORS (IC18.9)
FPGA_REF_N: CON_FMC_400PIN (J6.c23), CLOCK (IC4.6 R82.1)
FPGA_REF_P: CON_FMC_400PIN (J6.c22), CLOCK (IC4.5 R82.2)
GA0: FMC_CONNECTOR (IC12.2), CON_FMC_400PIN (J6.c34), VOLTAGE_MONITOR (IC7.11)
GA1: FMC_CONNECTOR (IC12.1), CON_FMC_400PIN (J6.d35), VOLTAGE_MONITOR (IC7.13)
GAIN_A_CH1: CON_FMC_400PIN (J6.c26), U_ANALOG_INPUT_A (T1D.5)
GAIN_A_CH2: CON_FMC_400PIN (J6.g30), U_ANALOG_INPUT_B (T1C.5)
GAIN_A_CH3: CON_FMC_400PIN (J6.h14), U_ANALOG_INPUT_C (T1B.5)
GAIN_A_CH4: CON_FMC_400PIN (J6.c14), U_ANALOG_INPUT_D (T1A.5)
GAIN_B_CH1: CON_FMC_400PIN (J6.d27), U_ANALOG_INPUT_A (T1D.2)
GAIN_B_CH2: CON_FMC_400PIN (J6.g27), U_ANALOG_INPUT_B (T1C.2)
GAIN_B_CH3: CON_FMC_400PIN (J6.g15), U_ANALOG_INPUT_C (T1B.2)
GAIN_B_CH4: CON_FMC_400PIN (J6.d12), U_ANALOG_INPUT_D (T1A.2)
LA00_CC_N: CON_FMC_400PIN (J6.g7), CLOCK (IC4.71 R83.1)
LA00_CC_P: CON_FMC_400PIN (J6.g6), CLOCK (IC4.70 R83.2)
LA01_CC_N: CON_FMC_400PIN (J6.d9), CLOCK (IC4.62)
LA01_CC_P: CON_FMC_400PIN (J6.d8), CLOCK (IC4.61)
LA02_P: CON_FMC_400PIN (J6.h7), ANALOG_INPUT_CTRL (IC8.6)
LA03_N: CON_FMC_400PIN (J6.g10), U_ADC2 (IC1A.20 R3A.1)
LA03_P: CON_FMC_400PIN (J6.g9), U_ADC2 (IC1A.21 R3A.2)
LA06_N: CON_FMC_400PIN (J6.c11), U_ANALOG_INPUT_D (T3A.2)
LA06_P: FMC_CONNECTOR (T7.2), CON_FMC_400PIN (J6.c10)
LA09_P: CON_FMC_400PIN (J6.d14), U_ANALOG_INPUT_C (T3B.2)
LA11_N: CON_FMC_400PIN (J6.h17), TRIGGER (IC17.7 R44.1)
LA11_P: CON_FMC_400PIN (J6.h16), TRIGGER (IC17.6 R44.2)
LA12_N: FMC_CONNECTOR (T4.2), CON_FMC_400PIN (J6.g16)
LA13_N: CON_FMC_400PIN (J6.d18), LEVEL_TRANSLATORS (IC19.8)
LA14_N: CON_FMC_400PIN (J6.c19), LEVEL_TRANSLATORS (IC19.3)
LA14_P: CON_FMC_400PIN (J6.c18), LEVEL_TRANSLATORS (IC19.6 R100.1)
LA15_N: CON_FMC_400PIN (J6.h20), LEVEL_TRANSLATORS (IC19.4)
LA15_P: CON_FMC_400PIN (J6.h19), LEVEL_TRANSLATORS (IC19.7)
LA16_P: CON_FMC_400PIN (J6.g18), LEVEL_TRANSLATORS (IC19.9)
LA19_N: FMC_CONNECTOR (T7.5), CON_FMC_400PIN (J6.h23)
LA19_P: CON_FMC_400PIN (J6.h22), LEVEL_TRANSLATORS (IC19.1)
LA22_P: CON_FMC_400PIN (J6.g24), TRIGGER (IC17.2 IC17.3 T5.2)
LA23_P: FMC_CONNECTOR (T4.5), CON_FMC_400PIN (J6.d23)
LA25_N: CON_FMC_400PIN (J6.g28), U_ANALOG_INPUT_B (T3C.2)
LA26_P: CON_FMC_400PIN (J6.d26), U_ANALOG_INPUT_A (T3D.2)
LA27_N: CON_FMC_400PIN (J6.c27), TRIGGER (R43.2 T5.5 T6.2)
LA30_N: CON_FMC_400PIN (J6.h35), U_ADC1 (IC1B.20 R3B.1)
LA30_P: CON_FMC_400PIN (J6.h34), U_ADC1 (IC1B.21 R3B.2)
LA32_P: CON_FMC_400PIN (J6.h37), LEVEL_TRANSLATORS (IC18.5)
LA33_N: CON_FMC_400PIN (J6.g37), LEVEL_TRANSLATORS (IC18.4)
NetC246_1: FMC_ADC_top (J5.1), CLOCK (C246.1)
NetD1_3: FMC_ADC_top (J7.1), TRIGGER (D1.3 IC17.1 IC17.4 R42.2)
NetJ1_1: FMC_ADC_top (J1.1), U_ANALOG_INPUT_A (R15D.1 R18D.2 SW3D.4 SW4D.4)
NetJ2_1: FMC_ADC_top (J2.1), U_ANALOG_INPUT_B (R15C.1 R18C.2 SW3C.4 SW4C.4)
NetJ3_1: FMC_ADC_top (J3.1), U_ANALOG_INPUT_C (R15B.1 R18B.2 SW3B.4 SW4B.4)
NetJ4_1: FMC_ADC_top (J4.1), U_ANALOG_INPUT_D (R15A.1 R18A.2 SW3A.4 SW4A.4)
OFFSET_CH1: U_ANALOG_INPUT_A (C83D.2 R6D.1 SW1D.3), ANALOG_INPUT_CTRL (C157.1 IC2.8 R50.2 TP1.1)
OFFSET_CH2: U_ANALOG_INPUT_B (C83C.2 R6C.1 SW1C.3), ANALOG_INPUT_CTRL (C162.1 IC13.8 R52.2 TP2.1)
OFFSET_CH3: U_ANALOG_INPUT_C (C83B.2 R6B.1 SW1B.3), ANALOG_INPUT_CTRL (C167.1 IC5.8 R54.2 TP3.1)
OFFSET_CH4: U_ANALOG_INPUT_D (C83A.2 R6A.1 SW1A.3), ANALOG_INPUT_CTRL (C172.1 IC6.8 R56.2 TP4.1)
POWER_GOOD: FMC_CONNECTOR (R99.1 T10.1), POWER_SUPPLY_1 (IC23.7 IC24.7 IC29.B4 IC29.D4), POWER_SUPPLY_2 (IC25.2 IC26.5 IC27.5 IC28.5)
REF_SEL: CLOCK (IC4.4), LEVEL_TRANSLATORS (IC19.12)
RESETn: CLOCK (IC4.19), LEVEL_TRANSLATORS (IC19.15)
SCL: FMC_CONNECTOR (IC12.6), CON_FMC_400PIN (J6.c30), VOLTAGE_MONITOR (IC7.15)
SCLK_ADC: U_ADC2 (IC1A.36), U_ADC1 (IC1B.36), LEVEL_TRANSLATORS (IC18.17 TP9.1)
SCLK_CLK: CLOCK (IC4.22), LEVEL_TRANSLATORS (IC19.17 TP14.1)
SDA: FMC_CONNECTOR (IC12.5), CON_FMC_400PIN (J6.c31), VOLTAGE_MONITOR (IC7.14)
SDIO_ADC: U_ADC2 (IC1A.35), U_ADC1 (IC1B.35), LEVEL_TRANSLATORS (IC18.16 TP10.1)
SDIO_CLK: CLOCK (IC4.23), LEVEL_TRANSLATORS (IC19.18 TP13.1)
SDO_CLK: CLOCK (IC4.24), LEVEL_TRANSLATORS (IC19.20 TP12.1)
STATUS0: CLOCK (IC4.55), LEVEL_TRANSLATORS (IC19.14)
STATUS1: CLOCK (IC4.56), LEVEL_TRANSLATORS (IC19.13)
SYSREF1_N: CLOCK (IC4.32), U_ADC1 (IC1B.59 R2B.1)
SYSREF1_P: CLOCK (IC4.31), U_ADC1 (IC1B.58 R2B.2)
SYSREF2_N: U_ADC2 (IC1A.59 R2A.1), CLOCK (IC4.65)
SYSREF2_P: U_ADC2 (IC1A.58 R2A.2), CLOCK (IC4.64)
VINA_N: U_ADC1 (IC1B.5), U_ANALOG_INPUT_A (IC9D.11)
VINA_P: U_ADC1 (IC1B.6), U_ANALOG_INPUT_A (IC9D.10)
VINB_N: U_ADC1 (IC1B.44), U_ANALOG_INPUT_B (IC9C.11)
VINB_P: U_ADC1 (IC1B.43), U_ANALOG_INPUT_B (IC9C.10)
VINC_N: U_ADC2 (IC1A.5), U_ANALOG_INPUT_C (IC9B.11)
VINC_P: U_ADC2 (IC1A.6), U_ANALOG_INPUT_C (IC9B.10)
VIND_N: U_ADC2 (IC1A.44), U_ANALOG_INPUT_D (IC9A.11)
VIND_P: U_ADC2 (IC1A.43), U_ANALOG_INPUT_D (IC9A.10)
VOCM: U_ANALOG_INPUT_D (C86A.2 IC9A.9), U_ANALOG_INPUT_C (C86B.2 IC9B.9), U_ANALOG_INPUT_B (C86C.2 IC9C.9), U_ANALOG_INPUT_A (C86D.2 IC9D.9), ANALOG_INPUT_CTRL (IC11.5 IC11.6)

## Assembly variants
Only populated components: not fitted C198A C198B C198C C198D C199A C199B C199C C199D R11A R11B